# Altium schematic sheet mesure_&_acquisition.SchDoc: Projet M1 2024
size A4; DrawnBy: J.CLEMENT & D.FOURNIER; Revision: V1.0 Rev A; SheetNumber: 5; SheetTotal: 7
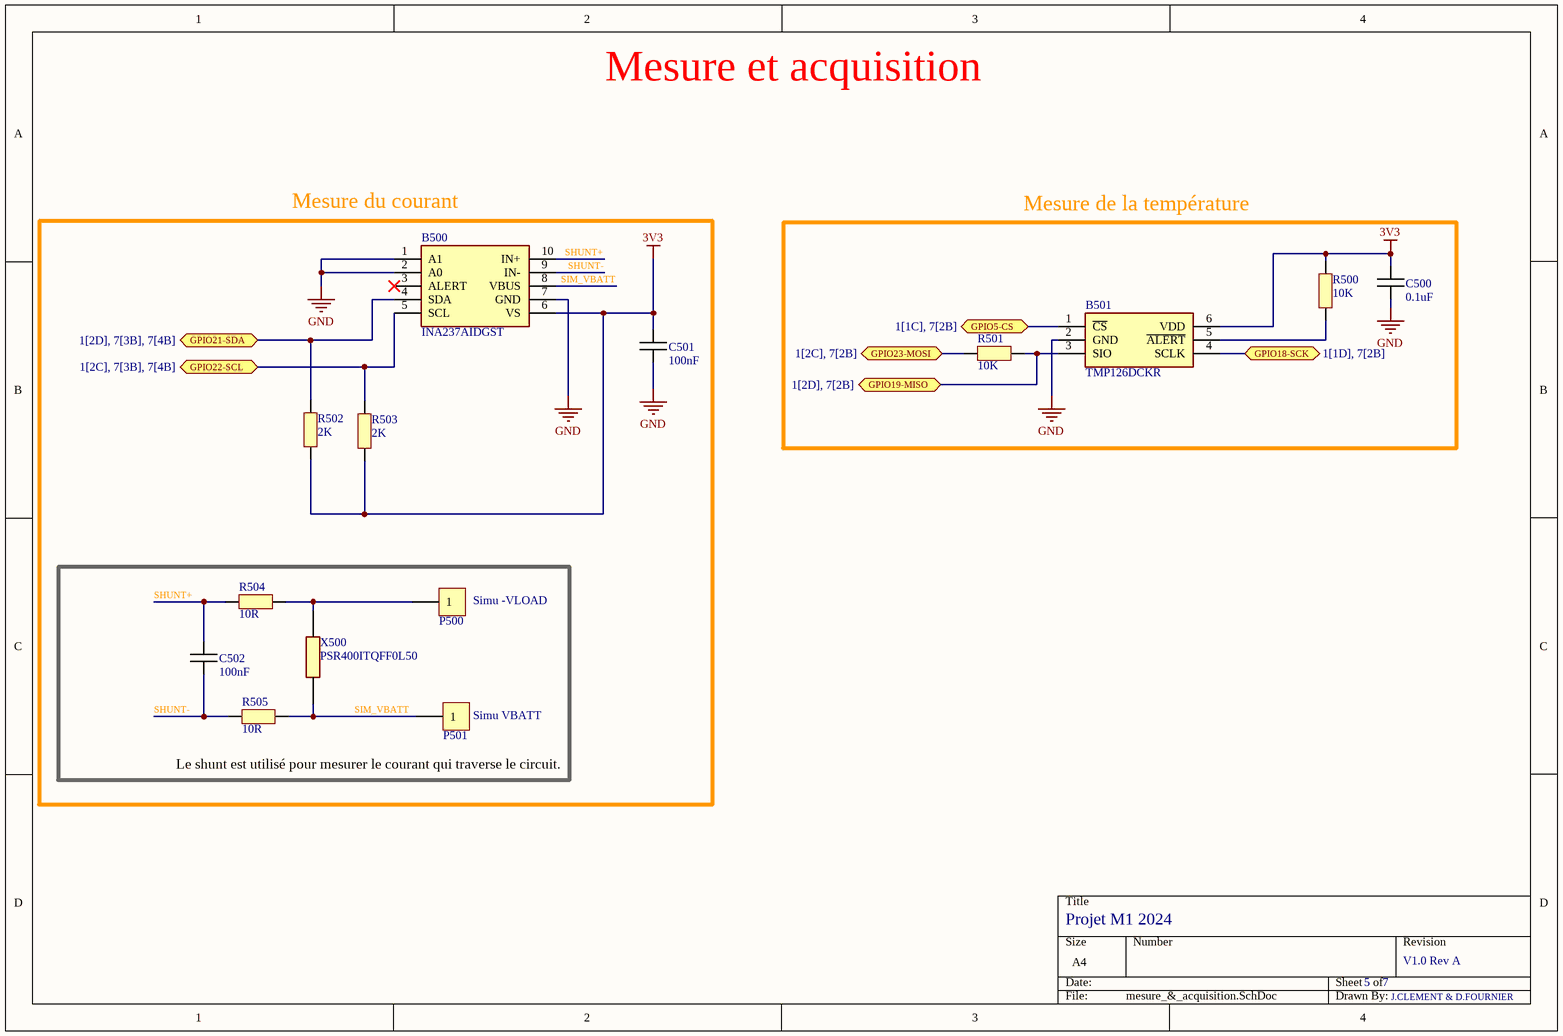
[diagram p0: mesure_&_acquisition.SchDoc]

## Parts
B500  INA237AIDGST  [SOP50P490X110-10N]
B501  TMP126DCKR  [SOT65P210X110-6N]
C500  0.1uF  [CAPA_0603]
C501  100nF  [CAPA_0603]
C502  100nF  [CAPA_0603]
P500  Plage CMS 10x5  [Plage CMS 10x5]  (value not drawn)  (no BOM)
P501  Plage CMS 10x5  [Plage CMS 10x5]  (value not drawn)  (no BOM)
R500  10K  [RES_0603]
R501  10K  [RES_0603]
R502  2K  [RES_0603]
R503  2K  [RES_0603]
R504  10R  [RES_0603]
R505  10R  [RES_0603]
X500  PSR400ITQFF0L50  [RESC10052X200N]

## Blocks framed on the sheet
Mesure du courant: B500 C501 C502 P500 P501 R502-R505 X500
Mesure de la température: B501 C500 R500 R501

## Ports
GPIO5-CS (bidir, see 1[1C], 7[2B]), GPIO18-SCK (bidir, see 1[1D], 7[2B]), GPIO19-MISO (bidir, see 1[2D], 7[2B]), GPIO21-SDA (bidir, see 1[2D], 7[3B], 7[4B]), GPIO22-SCL (bidir, see 1[2C], 7[3B], 7[4B]), GPIO23-MOSI (bidir, see 1[2C], 7[2B])

## Nets
3V3: B500.6(VS) B501.6(VDD) C500.1 C501.1 R500.2 R502.1 R503.1
GND: B500.1(A1) B500.2(A0) B500.7(GND) B501.2(GND) C500.2 C501.2
GPIO5-CS: B501.1(~{CS}) ; port GPIO5-CS
GPIO18-SCK: B501.4(SCLK) ; port GPIO18-SCK
GPIO19-MISO: B501.3(SIO) R501.2 ; port GPIO19-MISO
GPIO21-SDA: B500.4(SDA) R502.2 ; port GPIO21-SDA
GPIO22-SCL: B500.5(SCL) R503.2 ; port GPIO22-SCL
GPIO23-MOSI: R501.1 ; port GPIO23-MOSI
SHUNT+: B500.10(IN+) C502.1 R504.1
SHUNT-: B500.9(IN-) C502.2 R505.1
SIM_VBATT: B500.8(VBUS) P501.1 R505.2 X500.1
NetB501_5: B501.5(~{ALERT}) R500.1
NetP500_1: P500.1 R504.2 X500.2

Not connected (* = marked no-connect by the designer): B500 3(ALERT)*

## Notes on the sheet
- Mesure et acquisition
- (near P500) Simu -VLOAD
- (near P501) Simu VBATT
- Le shunt est utilisé pour mesurer le courant qui traverse le circuit.

## Library data of the parts
B500 = INA237AIDGST: Current Sense Amplifiers 85-V, 16-bit, I2C output current/voltage/power monitor with alert 10-VSSOP -40 to 125; Manufacturer_Name: Texas Instruments; Manufacturer_Part_Number: INA237AIDGST; Mouser Part Number: 595-INA237AIDGST
B501 = TMP126DCKR: Board Mount Temperature Sensors +/-0.25 C SPI temperature sensor with 175 C operation, CRC and slew-rate alert; Manufacturer_Name: Texas Instruments; Manufacturer_Part_Number: TMP126DCKR; Mouser Part Number: 595-TMP126DCKR
C500-C502 = Capacitor
P500 P501 = Plage CMS 10x5: Plage de report CMS 10x5mm; PN: L30; Value: Plage CMS 10x5; Footprint_statut: ok
R500-R505 = Resistor
X500 = PSR400ITQFF0L50: ROHM - PSR400ITQFF0L50 - SMD Current Sense Resistor, 500 ohm, PSR Series, 3921 [1052 Metric], 4 W, +/- 1%, Metal Strip; Manufacturer_Name: ROHM Semiconductor; Geometry.Height: 2mm; Manufacturer_Part_Number: PSR400ITQFF0L50; Mouser Part Number: 755-PSR400ITQFF0L50; Mouser Price/Stock: https://www.mouser.co.uk/ProductDetail/ROHM-Semiconductor/PSR400ITQFF0L50?qs=493kPxzlxfLaT1w5Mo%252BtHg%3D%3D; Arrow Part Number: *; Arrow Price/Stock: *; Datasheet Link: https://componentsearchengine.com/Datasheets/2/PSR400ITQFF0L50.pdf